# Altium schematic sheet System_Architecture.SchDoc: Draft System Architecture
size 431 x 279 mm; SheetNumber: 3; SheetTotal: 3
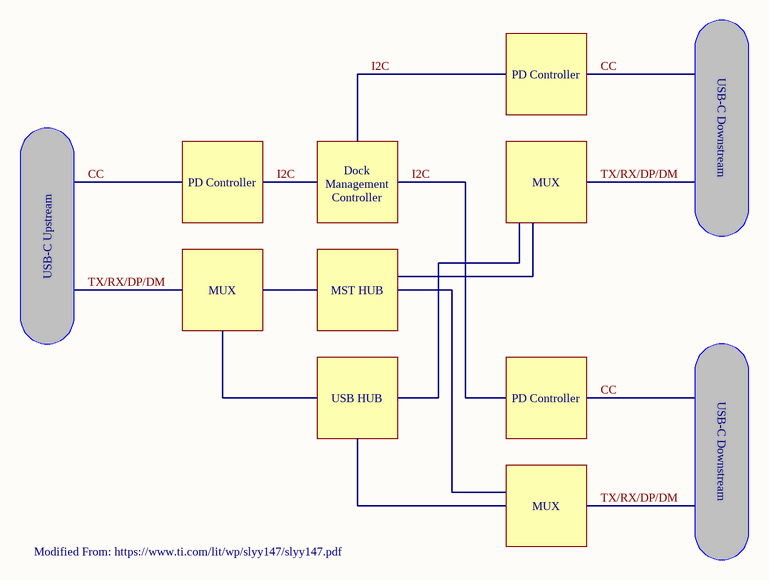
[diagram p0: System_Architecture.SchDoc]

## Notes on the sheet
- PD Controller
- USB-C Downstream
- Dock
  Management
  Controller
- MUX
- USB-C Upstream
- MST HUB
- USB HUB
- Modified From: https://www.ti.com/lit/wp/slyy147/slyy147.pdf
- DWG. NO.
- REV.
- SHT.
- THIS DOCUMENT AND THE DATA DISCLOSED HEREIN OR HEREWITH IS THE PROPERTY OF ALTIUM LIMITED AND MAY BE FREELY DISTRIBUTED IN WHOLE. NO RIGHTS ARE RESERVED OR EXPRESS OR IMPLIED WARANTEE GIVEN.
- REVISION
- DESCRIPTION
- DATE
- APPROVED
- ENG:
- APPROVALS
- PROJECT
- DSN:
- CHK:
- REFERENCE DOCUMENTS
- PROJECT REVISION:
- TITLE
- DOCUMENT REVISION:
- DESIGN ITEM:
- BOM:
- FAB DWG:
- PCB DWG:
- ASSY DWG:
- SCALE:
- SIZE
- B
- CAGE CODE
- FILE NAME
- DWG NO.
- SHEET
- OF
- REV